# EAGLE design stylo_input (EAGLE 5.10)
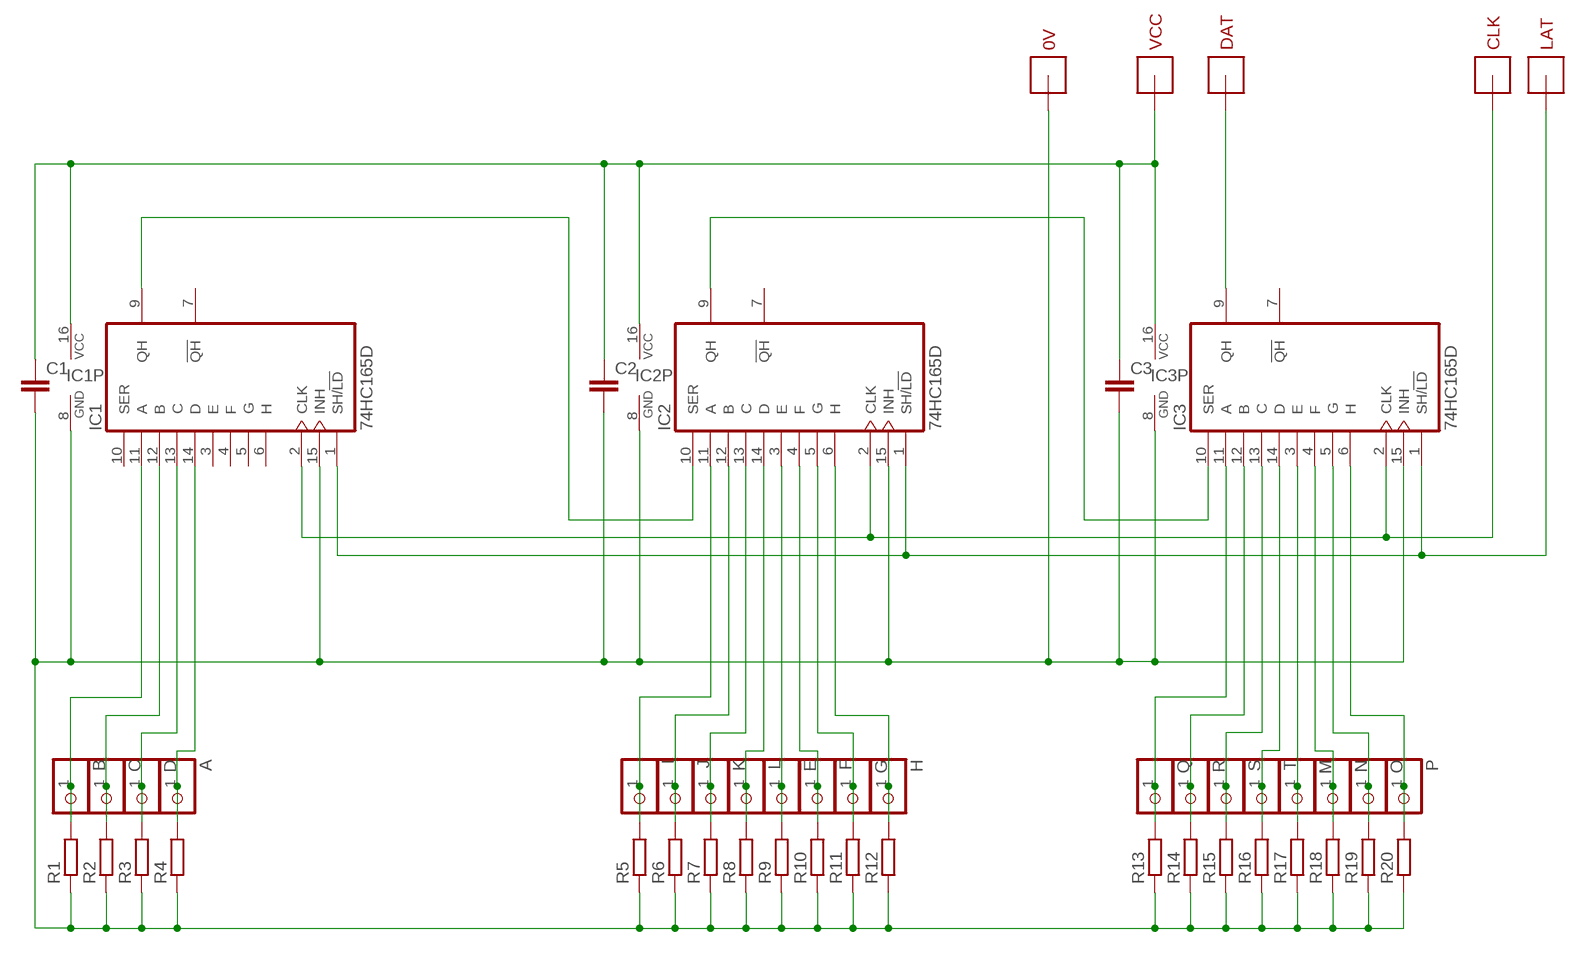
[diagram p0: schematic, sheet 1]

## Parts
0V  SMRIBBONCABLE  [SMRIBBONCABLE]
A  PINHD-1X1  [1X01]
B  PINHD-1X1  [1X01]
C  PINHD-1X1  [1X01]
C1  C-EUC0805  [C0805]
C2  C-EUC0805  [C0805]
C3  C-EUC0805  [C0805]
CLK  SMRIBBONCABLE  [SMRIBBONCABLE]
D  PINHD-1X1  [1X01]
DAT  SMRIBBONCABLE  [SMRIBBONCABLE]
E  PINHD-1X1  [1X01]
F  PINHD-1X1  [1X01]
G  PINHD-1X1  [1X01]
H  PINHD-1X1  [1X01]
I  PINHD-1X1  [1X01]
IC1  74HC165D  [SO16]
IC2  74HC165D  [SO16]
IC3  74HC165D  [SO16]
J  PINHD-1X1  [1X01]
K  PINHD-1X1  [1X01]
L  PINHD-1X1  [1X01]
LAT  SMRIBBONCABLE  [SMRIBBONCABLE]
M  PINHD-1X1  [1X01]
N  PINHD-1X1  [1X01]
O  PINHD-1X1  [1X01]
P  PINHD-1X1  [1X01]
Q  PINHD-1X1  [1X01]
R  PINHD-1X1  [1X01]
R1  R-EU_R0805  [R0805]
R2  R-EU_R0805  [R0805]
R3  R-EU_R0805  [R0805]
R4  R-EU_R0805  [R0805]
R5  R-EU_R0805  [R0805]
R6  R-EU_R0805  [R0805]
R7  R-EU_R0805  [R0805]
R8  R-EU_R0805  [R0805]
R9  R-EU_R0805  [R0805]
R10  R-EU_R0805  [R0805]
R11  R-EU_R0805  [R0805]
R12  R-EU_R0805  [R0805]
R13  R-EU_R0805  [R0805]
R14  R-EU_R0805  [R0805]
R15  R-EU_R0805  [R0805]
R16  R-EU_R0805  [R0805]
R17  R-EU_R0805  [R0805]
R18  R-EU_R0805  [R0805]
R19  R-EU_R0805  [R0805]
R20  R-EU_R0805  [R0805]
S  PINHD-1X1  [1X01]
T  PINHD-1X1  [1X01]
VCC  SMRIBBONCABLE  [SMRIBBONCABLE]

## Nets
DAT: DAT.1 IC3.9(QH)
GND: 0V.1 C1.2 C2.2 C3.2 IC1.8(GND) IC1.15(INH) IC2.8(GND) IC2.15(INH) IC3.8(GND) IC3.15(INH) R1.1 R2.1 R3.1 R4.1 R5.1 R6.1 R7.1 R8.1 R9.1 R10.1 R11.1 R12.1 R13.1 R14.1 R15.1 R16.1 R17.1 R18.1 R19.1 R20.1
N$4: B.1 IC1.11(A) R1.2
N$5: IC1.1(SH/!LD) IC2.1(SH/!LD) IC3.1(SH/!LD) LAT.1
N$6: IC1.9(QH) IC2.10(SER)
N$7: IC2.9(QH) IC3.10(SER)
N$8: C.1 IC1.12(B) R2.2
N$9: D.1 IC1.13(C) R3.2
N$10: A.1 IC1.14(D) R4.2
N$15: I.1 IC2.11(A) R5.2
N$16: IC2.12(B) J.1 R6.2
N$17: IC2.13(C) K.1 R7.2
N$18: IC2.14(D) L.1 R8.2
N$19: E.1 IC2.3(E) R9.2
N$20: F.1 IC2.4(F) R10.2
N$21: G.1 IC2.5(G) R11.2
N$22: H.1 IC2.6(H) R12.2
N$23: IC3.3(E) M.1 R17.2
N$24: IC3.14(D) R16.2 T.1
N$25: IC3.13(C) R15.2 S.1
N$26: IC3.12(B) R14.2 R.1
N$27: IC3.11(A) Q.1 R13.2
N$28: IC3.4(F) N.1 R18.2
N$29: IC3.5(G) O.1 R19.2
N$30: IC3.6(H) P.1 R20.2
SCK: CLK.1 IC1.2(CLK) IC2.2(CLK) IC3.2(CLK)
VDD: C1.1 C2.1 C3.1 IC1.16(VCC) IC2.16(VCC) IC3.16(VCC) VCC.1
Unconnected: IC1.3(E) IC1.4(F) IC1.5(G) IC1.6(H) IC1.7(!QH) IC1.10(SER) IC2.7(!QH) IC3.7(!QH)

## Library data of the parts
0V CLK DAT LAT VCC = jasons_stuff:SMRIBBONCABLE
A B C D E F G H I J K L M N O P Q R S T = adafruit:PINHD-1X1: Pin header 1x1 for 0.1" spacing With round pins
C1-C3 = rcl:C-EU: CAPACITOR, European symbol
IC1-IC3 = 74xx-eu:74*165: 8-bit parallel load SHIFT REGISTER
R1-R20 = rcl:R-EU_: RESISTOR, European symbol

## Board
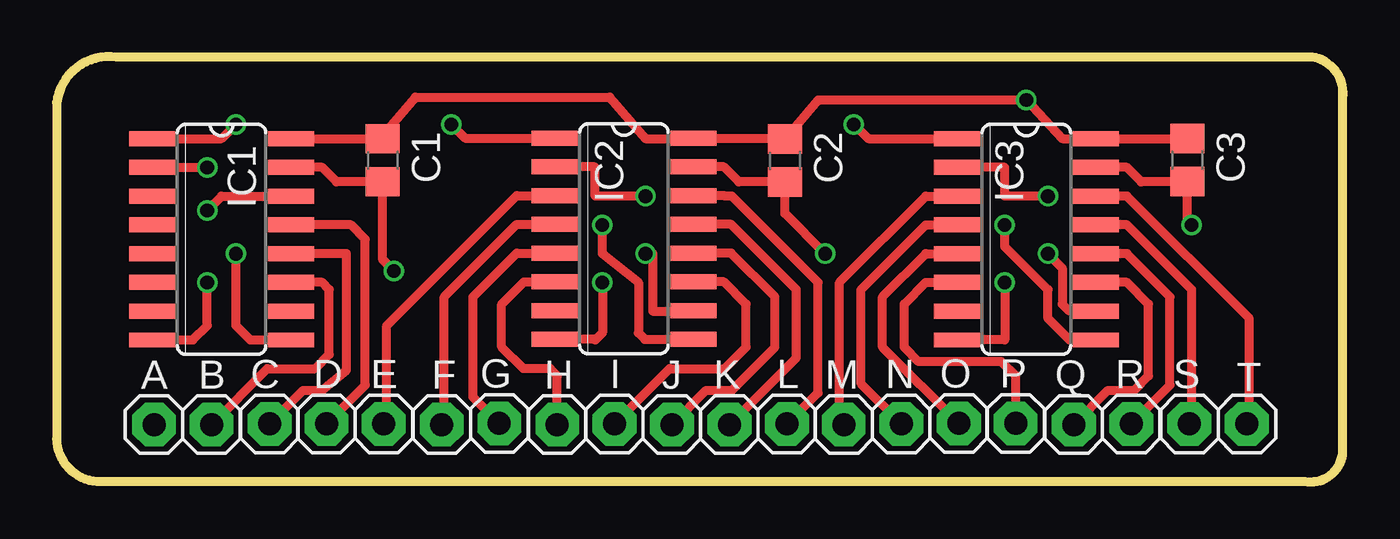
[diagram p1: board, top side]
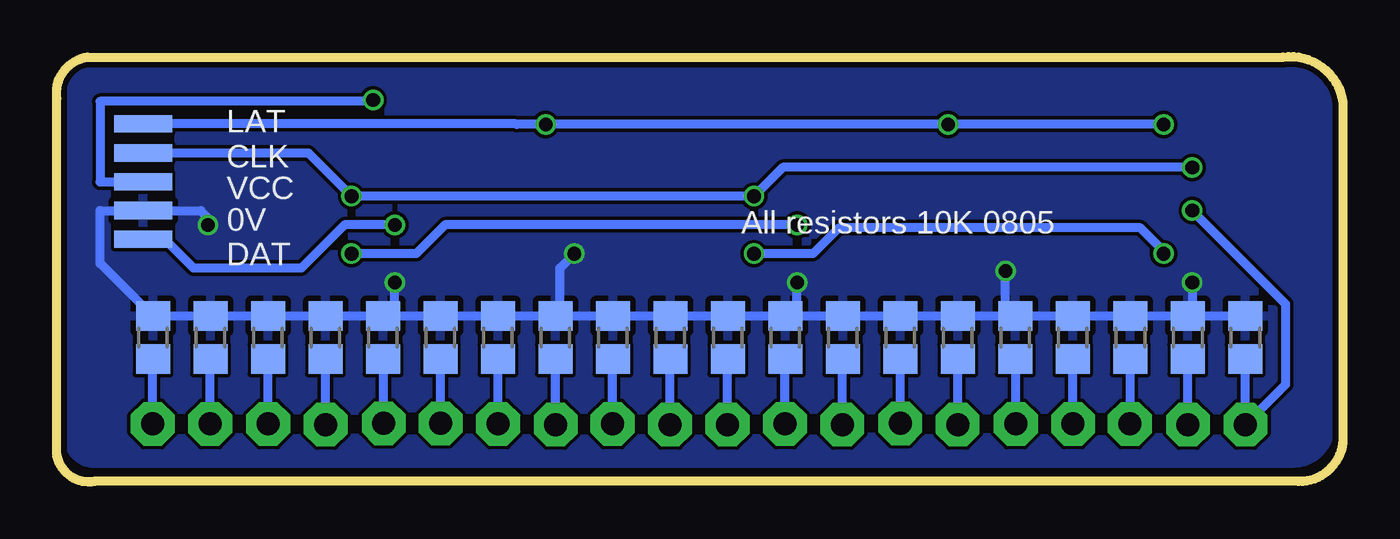
[diagram p2: board, bottom side, seen from below]

Size 56.84 x 18.79 mm. Coordinates in mm from the lower left corner, seen from the top.
Outline: 0,1.9 arc90 1.96,0.02 55.17,0.02 arc90 56.82,1.19 56.82,16.94 arc90 55.47,18.77 2.64,18.77 arc90 0,16.76 0,1.9
Copper layers (1*16): Top 0.035mm / dielectric 1.5mm / Bottom 0.035mm
Design rules "ITEADstudio_DRC": minimum track width 6mil, minimum drill 12mil, track to track 6mil, track to pad 6mil, pad to pad 6mil, via to via 6mil, smd to smd 0mil, copper to edge 10mil, drill to drill 10mil, minimum pad ring 10mil, minimum via ring 6mil, stop-mask expansion 2mil, vias tented up to drill 100mil, thermal gap 10mil

### Footprints (pad centres in the part's own frame; a part is rotated, then mirrored left to right if it is on the bottom)
SMRIBBONCABLE = smd 2.54 x 0.762: 1 0,0
1X01 = drill 1.016 pad 1.93 octagon: 1 0,0
C0805 = smd 1.3 x 1.5: 1 -0.95,0; 2 0.95,0
SO16 = smd 0.66 x 2.032: 1 -4.445,-3.073; 2 -3.175,-3.073; 3 -1.905,-3.073; 4 -0.635,-3.073; 5 0.635,-3.073; 6 1.905,-3.073; 7 3.175,-3.073; 8 4.445,-3.073; 9 4.445,3.073; 10 3.175,3.073; 11 1.905,3.073; 12 0.635,3.073; 13 -0.635,3.073; 14 -1.905,3.073; 15 -3.175,3.073; 16 -4.445,3.073
R0805 = smd 1.3 x 1.5: 1 -0.95,0; 2 0.95,0

### Placement (x,y rotation side)
0V  53.01,11.98 0 bottom
A  4.31,2.53 0 top
B  6.85,2.53 0 top
C  9.41,2.56 0 top
C1  14.41,14.21 270 top
C2  32.18,14.19 270 top
C3  49.96,14.22 270 top
CLK  53.01,14.52 0 bottom
D  11.93,2.56 0 top
DAT  53.01,10.71 0 bottom
E  14.45,2.56 0 top
F  17.02,2.53 0 top
G  19.56,2.59 0 top
H  22.12,2.53 0 top
I  24.65,2.56 0 top
IC1  7.29,10.71 270 top
IC2  25.07,10.74 270 top
IC3  42.85,10.71 270 top
J  27.19,2.53 0 top
K  29.73,2.53 0 top
L  32.27,2.56 0 top
LAT  53.01,15.82 0 bottom
M  34.79,2.53 0 top
N  37.33,2.56 0 top
O  39.87,2.59 0 top
P  42.38,2.59 0 top
Q  44.95,2.53 0 top
R  47.49,2.56 0 top
R1  6.86,6.37 270 bottom
R2  9.4,6.37 270 bottom
R3  11.94,6.37 270 bottom
R4  4.32,6.37 270 bottom
R5  24.64,6.37 270 bottom
R6  27.18,6.37 270 bottom
R7  29.72,6.37 270 bottom
R8  32.26,6.37 270 bottom
R9  14.48,6.37 270 bottom
R10  17.02,6.37 270 bottom
R11  19.56,6.37 270 bottom
R12  22.1,6.37 270 bottom
R13  44.96,6.37 270 bottom
R14  47.5,6.37 270 bottom
R15  50.04,6.37 270 bottom
R16  52.58,6.37 270 bottom
R17  34.8,6.37 270 bottom
R18  37.34,6.37 270 bottom
R19  39.88,6.37 270 bottom
R20  42.42,6.37 270 bottom
S  50.05,2.56 0 top
T  52.59,2.56 0 top
VCC  53.01,13.25 0 bottom

### Tracks (layer width: path | path; a pad name or v marks a point on that pad's centre or on a via)
DAT  (via drill 0.6)
  Top 0.406: IC3.9 44.75,6.27 43.8,7.22 43.8,8.49 41.9,10.4 v41.9,11.35
  Bottom 0.406: v41.9,11.35 44.12,11.35 46.02,9.44 50.79,9.44 52.06,10.71 DAT.1
GND  (via drill 0.6)
  Top 0.406: IC1.8 6.02,6.27 6.65,6.9 v6.65,8.81 | 23.82,6.29 IC2.8 | 23.82,6.29 23.8,6.27 | IC3.8 41.9,6.27 v41.9,8.81 | v24.12,8.81 24.12,6.59 23.82,6.29 | IC1.15 11.73,13.89 12.37,13.25 C1.2 14.41,9.81 v14.91,9.32 | IC2.15 29.49,13.91 30.15,13.25 C2.2 32.18,11.86 v33.96,10.08 | IC3.15 47.29,13.89 47.93,13.25 49.95,13.25 C3.2 49.96,11.54 v50.15,11.35
  Bottom 0.406: v6.65,8.81 6.65,7.52 | R5.1 24.43,7.52 | R20.1 42.21,7.52 | v41.9,8.81 41.9,7.84 R20.1 | v24.12,8.81 24.12,7.84 R5.1 | v33.96,10.08 34.59,9.44 34.59,7.52 R17.1 | R9.1 R10.1 R11.1 R12.1 R5.1 | R5.1 R6.1 R7.1 R8.1 R17.1 | R17.1 R18.1 R19.1 R20.1 | R20.1 R13.1 R14.1 R15.1 R16.1 54.91,9.66 54.91,11.98 0V.1 50.47,11.98 50.15,11.67 v50.15,11.35 | R9.1 R3.1 R2.1 R1.1 R4.1 | v14.91,9.32 14.91,7.75 R9.1
  pour Bottom: 2.21,0.81 55.17,0.81 arc90 56.31,1.95 56.31,17.06 arc90 55.17,18.21 2.08,18.21 arc90 0.56,16.68 0.56,2.46 arc90
N$4
  Top 0.406: IC1.11 11.73,8.81 12.05,8.49 12.05,5.63 11.42,5 9.31,5 B.1
  Bottom 0.406: R1.2 6.86,2.55 B.1
N$5  (via drill 0.6)
  Top 0.406: IC3.1 35.86,15.16 v35.23,15.79 | IC1.1 7.29,15.16 v7.92,15.79 | IC2.1 18.06,15.18 v17.45,15.79
  Bottom 0.406: LAT.1 36.52,15.82 36.5,15.79 v35.23,15.79 v17.45,15.79 v7.92,15.79
N$6  (via drill 0.6)
  Top 0.406: IC1.9 8.56,6.27 7.92,6.9 v7.92,10.08 | IC2.10 28.12,7.54 26.34,7.54 26.34,10.08 v26.02,10.08
  Bottom 0.406: v7.92,10.08 7.92,10.21 8.94,11.22 22.28,11.22 23.42,10.08 v26.02,10.08
N$7  (via drill 0.6)
  Top 0.406: IC2.9 26,6.29 25.7,6.59 25.7,8.81 24.12,10.08 v24.12,11.35 | IC3.10 44.75,7.54 44.44,7.86 44.44,9.44 v43.8,10.08
  Bottom 0.406: v24.12,11.35 39.67,11.35 40.94,10.08 v43.8,10.08
N$8
  Top 0.406: IC1.12 12.81,10.08 12.81,4.93 11.73,4.05 10.9,4.05 C.1
  Bottom 0.406: 9.41,5.41 R2.2 9.4,2.57 C.1
N$9
  Top 0.406: IC1.13 13,11.35 13.64,10.71 13.64,4.27 D.1
  Bottom 0.406: R3.2 D.1
N$10  (via drill 0.6)
  Top 0.406: IC1.14 7.29,12.62 v6.65,11.98
  Bottom 0.406: R4.2 4.3,5.41 A.1 2.53,4.31 2.53,7.86 v6.65,11.98
N$15
  Top 0.406: IC2.11 29.49,8.83 30.47,7.86 30.47,5.95 29.51,5 27.09,5 I.1
  Bottom 0.406: I.1 24.65,5.41 R5.2
N$16
  Top 0.406: IC2.12 29.81,10.1 31.74,8.17 31.74,5.95 29.83,4.05 28.7,4.05 J.1
  Bottom 0.406: J.1 27.19,5.41 R6.2
N$17
  Top 0.406: IC2.13 29.81,11.37 32.69,8.49 32.69,5.49 K.1
  Bottom 0.406: K.1 29.73,5.41 R7.2
N$18
  Top 0.406: IC2.14 29.49,12.64 29.51,12.62 29.83,12.62 33.64,8.81 33.64,3.93 L.1
  Bottom 0.406: L.1 32.27,5.41 R8.2
N$19
  Top 0.406: IC2.3 20.33,12.64 14.59,6.9 14.59,2.7 E.1
  Bottom 0.406: E.1 14.45,5.39 R9.2
N$20
  Top 0.406: IC2.4 20.33,11.37 17.13,8.17 17.13,2.65 F.1
  Bottom 0.406: F.1 R10.2
N$21
  Top 0.406: IC2.5 20.33,10.1 18.4,8.17 18.4,3.74 G.1
  Bottom 0.406: G.1 R11.2
N$22
  Top 0.406: IC2.6 20.65,8.83 19.67,7.86 19.67,5.95 20.62,5 21.81,5 22.12,4.68 H.1
  Bottom 0.406: H.1 22.12,5.39 R12.2
N$23
  Top 0.406: IC3.3 38.4,12.62 34.59,8.81 34.59,2.73 M.1
  Bottom 0.406: M.1 34.78,5.41 R17.2
N$24
  Top 0.406: IC3.14 47.29,12.62 52.69,7.22 52.69,2.66 T.1
  Bottom 0.406: T.1 52.59,5.41 R16.2
N$25
  Top 0.406: IC3.13 47.29,11.35 50.15,8.49 50.15,3.2 50.05,3.09 S.1
  Bottom 0.406: S.1 50.05,5.41 R15.2
N$26
  Top 0.406: IC3.12 47.29,10.08 49.2,8.17 49.2,4.27 R.1
  Bottom 0.406: R.1 47.49,5.41 R14.2
N$27
  Top 0.406: IC3.11 47.29,8.81 48.25,7.86 48.25,4.68 47.61,4.05 46.46,4.05 Q.1
  Bottom 0.406: Q.1 44.95,5.41 R13.2
N$28
  Top 0.406: IC3.4 38.4,11.35 35.55,8.49 35.55,4.34 N.1
  Bottom 0.406: N.1 37.32,5.41 R18.2
N$29
  Top 0.406: IC3.5 38.4,10.08 36.5,8.17 36.5,5.95 O.1
  Bottom 0.406: O.1 39.87,5.41 R19.2
N$30
  Top 0.406: IC3.6 38.4,8.81 37.45,7.86 37.45,5.95 38.09,5.32 41.74,5.32 42.38,4.68 P.1
  Bottom 0.406: P.1 42.38,5.38 R20.2
SCK  (via drill 0.6)
  Top 0.406: IC2.2 23.77,13.91 23.8,13.89 23.8,12.62 v26.02,12.62 | IC3.2 41.9,13.89 41.9,12.62 v43.8,12.62 | IC1.2 v6.65,13.89
  Bottom 0.406: v6.65,13.89 24.75,13.89 v26.02,12.62 v43.8,12.62 45.71,14.52 CLK.1
VDD  (via drill 0.6)
  Top 0.406: IC1.16 C1.1 14.41,15.3 15.86,17 24.43,17 26.02,15.16 28.12,15.16 IC2.16 32.14,15.18 C2.1 33.66,16.87 v42.85,16.87 44.44,15.16 IC3.16 49.95,15.16 C3.1
  Bottom 0.406: VCC.1 54.91,13.25 54.91,16.81 42.79,16.81 v42.85,16.87

### Text on the board
bNames: All resistors 10K 0805
tValues: midi stylophone input board rev 2 | hotchk155